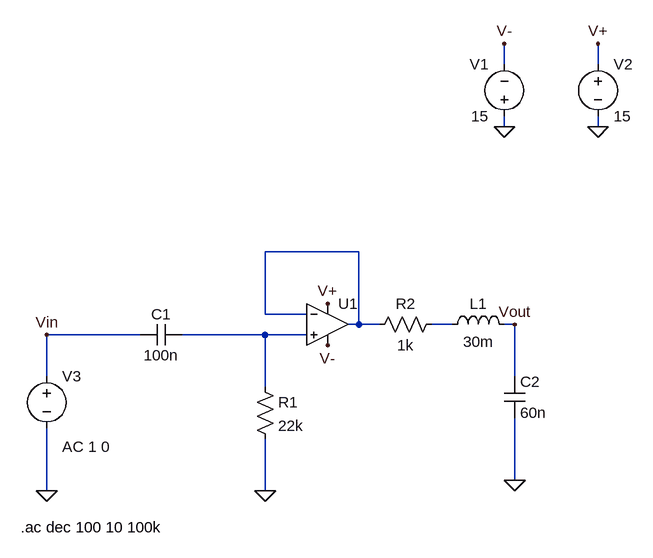
[diagram p0: schematic Filtro_CR-RLC.asc]
Filtro_CR-RLC.asc, the LTspice schematic file:
Version 4.1
SHEET 1 1080 680
WIRE 880 -336 880 -368
WIRE 1024 -336 1024 -368
WIRE 880 -240 880 -256
WIRE 1024 -240 1024 -256
WIRE 656 -48 512 -48
WIRE 512 48 512 -48
WIRE 576 48 512 48
WIRE 656 64 656 -48
WIRE 656 64 640 64
WIRE 688 64 656 64
WIRE 800 64 768 64
WIRE 896 64 880 64
WIRE 320 80 176 80
WIRE 512 80 384 80
WIRE 576 80 512 80
WIRE 176 144 176 80
WIRE 896 144 896 64
WIRE 512 160 512 80
WIRE 896 304 896 208
WIRE 176 320 176 224
WIRE 512 320 512 240
FLAG 608 32 V+
FLAG 608 96 V-
FLAG 880 -368 V-
FLAG 1024 -368 V+
FLAG 880 -240 0
FLAG 1024 -240 0
FLAG 176 320 0
FLAG 896 304 0
FLAG 512 320 0
FLAG 176 80 Vin
FLAG 896 64 Vout
SYMBOL OpAmps\\UniversalOpAmp 608 64 R0
SYMATTR InstName U1
SYMBOL voltage 880 -240 R180
WINDOW 0 24 96 Left 2
WINDOW 3 24 16 Left 2
WINDOW 123 0 0 Left 0
WINDOW 39 0 0 Left 0
SYMATTR InstName V1
SYMATTR Value 15
SYMBOL voltage 1024 -352 R0
WINDOW 123 0 0 Left 0
WINDOW 39 0 0 Left 0
SYMATTR InstName V2
SYMATTR Value 15
SYMBOL voltage 176 128 R0
WINDOW 123 24 124 Left 2
WINDOW 39 0 0 Left 0
SYMATTR Value2 AC 1 0
SYMATTR InstName V3
SYMATTR Value ""
SYMBOL res 784 48 R90
WINDOW 0 0 56 VBottom 2
WINDOW 3 32 56 VTop 2
SYMATTR InstName R2
SYMATTR Value 1k
SYMBOL cap 880 144 R0
SYMATTR InstName C2
SYMATTR Value 60n
SYMBOL cap 384 64 R90
WINDOW 0 0 32 VBottom 2
WINDOW 3 32 32 VTop 2
SYMATTR InstName C1
SYMATTR Value 100n
SYMBOL res 496 144 R0
SYMATTR InstName R1
SYMATTR Value 22k
SYMBOL ind 784 80 R270
WINDOW 0 32 56 VTop 2
WINDOW 3 5 56 VBottom 2
SYMATTR InstName L1
SYMATTR Value 30m
SYMATTR SpiceLine Rser=0
TEXT 136 376 Left 2 !.ac dec 100 10 100k

The netlist it stands for:
* Filtro_CR-RLC.asc
X§U1 N003 N001 V+ V- N001 level1 Avol=1Meg GBW=10Meg Vos=0 En=0 Enk=0 In=0 Ink=0 Rin=500Meg  ; pins In+ In- V+ V- OUT
V1 0 V- 15
V2 V+ 0 15
V3 Vin 0 AC 1 0
R2 N002 N001 1k
C2 Vout 0 60n
C1 N003 Vin 100n
R1 N003 0 22k
L1 N002 Vout 30m Rser=0
.ac dec 100 10 100k
.lib UniversalOpAmp1.lib
.backanno
.end